# Altium schematic sheet MCU.SchDoc
size 177 x 241 mm; SheetNumber: 7; SheetTotal: 9
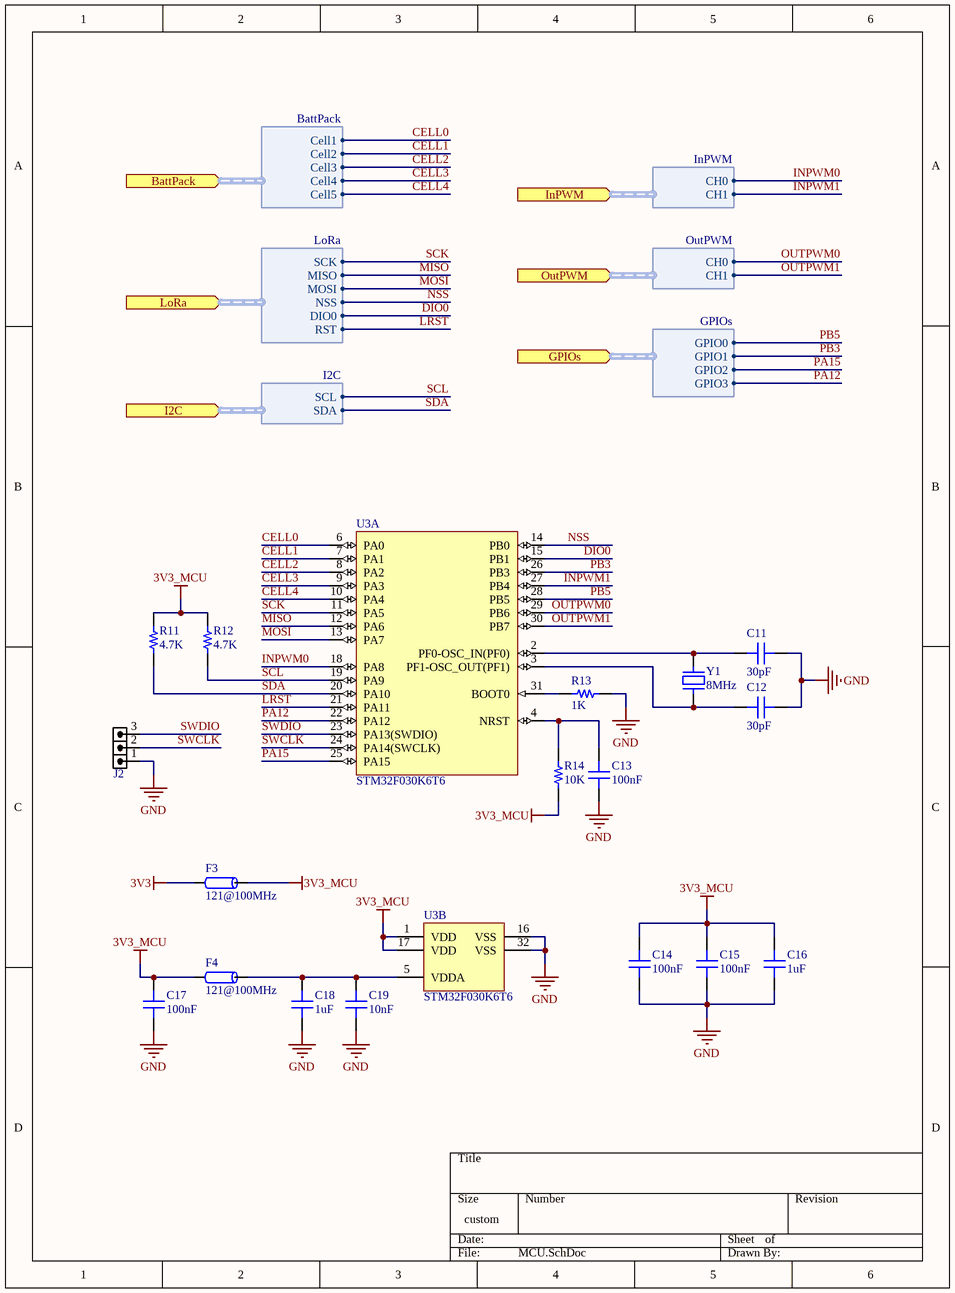
[diagram p0: MCU.SchDoc]

## Parts
C11  30pF  [CAP 0603_1608]
C12  30pF  [CAP 0603_1608]
C13  100nF  [CAP 0603_1608]
C14  100nF  [CAP 0603_1608]
C15  100nF  [CAP 0603_1608]
C16  1uF  [CAP 0603_1608]
C17  100nF  [CAP 0603_1608]
C18  1uF  [CAP 0603_1608]
C19  10nF  [CAP 0603_1608]
F3  121@100MHz  [Ferrite-0805]
F4  121@100MHz  [Ferrite-0805]
J2  HDRM3  [HDR_M_1X3]  (value not drawn)
R11  4.7K  [RES 0603_1608]
R12  4.7K  [RES 0603_1608]
R13  1K  [RES 0603_1608]
R14  10K  [RES 0603_1608]
U3  STM32F030K6T6  [LQFP-32 7X7MM P0.8MM]  (parts A,B of 2)
Y1  8MHz  [HC-49S SMD]

## Ports
BattPack (in, harness BattPack), GPIOs (in, harness GPIOs), I2C (in, harness I2C), InPWM (in, harness InPWM), LoRa (in, harness LoRa), OutPWM (in, harness OutPWM)

## Harnesses
BattPack: Cell1, Cell2, Cell3, Cell4, Cell5
LoRa: SCK, MISO, MOSI, NSS, DIO0, RST
I2C: SCL, SDA
InPWM: CH0, CH1
OutPWM: CH0, CH1
GPIOs: GPIO0, GPIO1, GPIO2, GPIO3

## Nets
3V3: F3.1
3V3_MCU: C14.2 C15.2 C16.2 C17.2 F3.2 F4.1 R11.2 R12.2 R14.1 U3.1(VDD) U3.17(VDD)
GND: C11.2 C12.2 C13.1 C14.1 C15.1 C16.1 C17.1 C18.1 C19.1 J2.1 R13.2 U3.16(VSS) U3.32(VSS)
CELL0: U3.6(PA0) ; port BattPack.Cell1
CELL1: U3.7(PA1) ; port BattPack.Cell2
CELL2: U3.8(PA2) ; port BattPack.Cell3
CELL3: U3.9(PA3) ; port BattPack.Cell4
CELL4: U3.10(PA4) ; port BattPack.Cell5
DIO0: U3.15(PB1) ; port LoRa.DIO0
INPWM0: U3.18(PA8) ; port InPWM.CH0
INPWM1: U3.27(PB4) ; port InPWM.CH1
LRST: U3.21(PA11) ; port LoRa.RST
MISO: U3.12(PA6) ; port LoRa.MISO
MOSI: U3.13(PA7) ; port LoRa.MOSI
NSS: U3.14(PB0) ; port LoRa.NSS
OUTPWM0: U3.29(PB6) ; port OutPWM.CH0
OUTPWM1: U3.30(PB7) ; port OutPWM.CH1
PA12: U3.22(PA12) ; port GPIOs.GPIO3
PA15: U3.25(PA15) ; port GPIOs.GPIO2
PB3: U3.26(PB3) ; port GPIOs.GPIO1
PB5: U3.28(PB5) ; port GPIOs.GPIO0
SCK: U3.11(PA5) ; port LoRa.SCK
SCL: R12.1 U3.19(PA9) ; port I2C.SCL
SDA: R11.1 U3.20(PA10) ; port I2C.SDA
SWCLK: J2.2 U3.24(PA14(SWCLK))
SWDIO: J2.3 U3.23(PA13(SWDIO))
NetC11_1: C11.1 U3.2(PF0-OSC_IN(PF0)) Y1.2
NetC12_1: C12.1 U3.3(PF1-OSC_OUT(PF1)) Y1.1
NetC13_2: C13.2 R14.2 U3.4(NRST)
NetC18_2: C18.2 C19.2 F4.2 U3.5(VDDA)
NetR13_1: R13.1 U3.31(BOOT0)

## Library data of the parts
C11-C19 = Cap 0603: SMT Capacitor
  C11 C12: VALUE: 30pF
  C13-C15 C17: VALUE: 100nF
  C16 C18: VALUE: 1uF
  C19: VALUE: 10nF
F3 F4 = Ferrite Bead
J2 = HDR_M_1X3: CONN, HEADER, Male, pitch: 2.54mm, 3POS; VALUE: HDRM3
R11-R14 = Res 0603: SMT Resistor
  R11 R12: VALUE: 4.7K
  R13: VALUE: 1K
  R14: VALUE: 10K
U3 = STM32F030K6T6: ARM Cortex-M0 32-bit MCU, 32 KB Flash, 4 KB Internal RAM, 26 I/Os, 32-pin LQFP, -40 to 85 degC, Tray; FLASH Size (Prog) (kB): 32; I/Os (High Current): 26; Internal RAM Size (kB): 4; Operating Frequency(F) (Processor speed) (MHz): 48; Supply Voltage(Vcc) min (V): 2.4; DatasheetVersion: Rev. 1; PackageVersion: Rev. 1, 07/2013; PackageReference: LQFP32; PackageDescription: 32-Pin Low Profile Quad Flat Package, 7 x 7 mm Body, 0.8 mm Pitch; Supplier 1: Digi-Key; Supplier Part Number 1: 497-14046-ND; Supplier 2: Newark; Supplier Part Number 2: 19X6194; Supplier 3: Mouser; Supplier Part Number 3: 511-STM32F030K6T6; Core: ARM Cortex-M0; Packing: Tray; Mounting Technology: Surface Mount; PartNumber: STM32F030K6T6; ComponentLink1Description: Manufacturer URL; ComponentLink1URL: http://www.st.com/web/en/home.html; ComponentLink2Description: Datasheet; ComponentLink2URL: http://www.st.com/st-web-ui/static/active/en/resource/technical/document/datasheet/DM00088500.pdf; ComponentLink3Description: Package Specification; ComponentLink3URL: http://www.st.com/st-web-ui/static/active/en/resource/technical/document/datasheet/DM00088500.pdf
Y1 = Crystal HC-49S SMD 8MHz: SMT Crystal; PartNumber: ABLS-8.000MHZ-K4T